# Altium schematic sheet 12V_Buck.SchDoc: 12.1V Buck Converter
size A; DrawnBy: Brent; DocumentNumber: XXXXXX; Revision: A; SheetNumber: 7; SheetTotal: 8
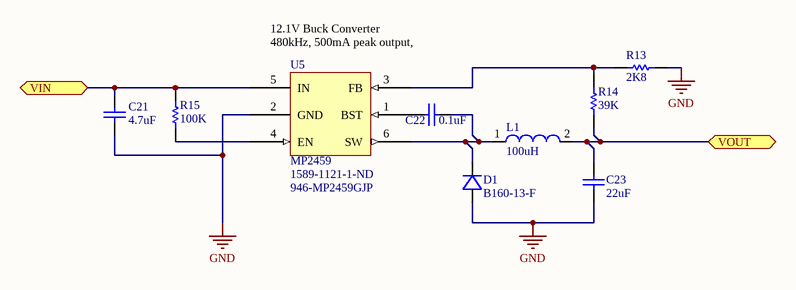
[diagram p0: 12V_Buck.SchDoc]

## Parts
C21  4.7uF  [CAPC1210(3225)280_L]
C22  0.1uF  [CAPC0603(1608)100_L]
C23  22uF  [CAPC1210(3225)210_L]
D1  B160-13-F  [DO-214AC]
L1  100uH  [WE-PD-XS-PB]
R13  2K8  [RESC0603(1608)_L]
R14  39K  [RESC0603(1608)_L]
R15  100K  [RESC0603(1608)_N]
U5  MP2459  Supplier Part Number 1: 1589-1121-1-ND  Supplier Part Number 2: 946-MP2459GJP  [TSOT23-6]

## Ports
VIN, VOUT

## Nets
GND: C21.1 C23.1 D1.2(A) R13.1 U5.2(GND)
VIN: C21.2 R15.2 U5.5(IN) ; port VIN
VOUT: C23.2 L1.2 R14.2 ; port VOUT
NetC22_1: C22.1 U5.1(BST)
NetC22_2: C22.2 D1.1(K) L1.1 U5.6(SW)
NetR13_2: R13.2 R14.1 U5.3(FB)
NetR15_1: R15.1 U5.4(EN)

## Notes on the sheet
- (near U5) 12.1V Buck Converter
  480kHz, 500mA peak output, 4.5V-55V input

## Library data of the parts
C21 = CMP-1038-02163-1: CAP 4.7uF 50V ±20% 1210 (3225 Metric) Thickness 2.8mm SMD; Case-EIA: 1210; Case-Metric: 3225; Tolerance: Â±20%; Max Thickness: 2.8 mm; Rated Voltage: 50 V; Technology: SMT; Value: 4.7uF
C22 = CMP-1035-02595-1: CAP 100nF 100V ±10% 0603 (1608 Metric) Thickness 1mm SMD; Tolerance: Â±10%; Case-EIA: 0603; Case-Metric: 1608; Rated Voltage: 100 V; Value: 100nF; Technology: SMT; Max Thickness: 1 mm
C23 = CMP-1038-02278-1: CAP 22uF 16V ±20% 1210 (3225 Metric) Thickness 2.05mm SMD; Case-Metric: 3225; Case-EIA: 1210; Tolerance: Â±20%; Rated Voltage: 16 V; Value: 22uF; Technology: SMT; Max Thickness: 2.05 mm
L1 = CMP-0227-00265-1: SMD-Shielded Power Inductor WE-PD, L = 100 µH; Inductance: 100 ÂµH; ComponentLink1Description: Manufacturer Link; PackageDescription: SMD Inductor, 2-Leads, Body 5.9 x 6.2 mm; ComponentLink1URL: http://www.we-online.com; ComponentLink2URL: http://www.we-online.de/katalog/media/pdf/744778520.pdf; ComponentLink2Description: Datasheet; PackageVersion: 2004; DatasheetVersion: ver 2, Oct-2004; PackageReference: WE-PD-XS-PB
R13 = CMP-1012-00559-1: 2K8 0.1W 1% 0603 (1608 Metric)  SMD; Case-EIA: 0603; Case-Metric: 1608; Value: 2800.00 Ohm; Tolerance: 1 %; Technology: SMT; Power: 0.1 W
R14 = CMP-1012-00689-1: 39K 0.1W 1% 0603 (1608 Metric)  SMD; Case-Metric: 1608; Case-EIA: 0603; Value: 39000.00 Ohm; Technology: SMT; Tolerance: 1 %; Power: 0.1 W
R15 = CMP-1012-00736-1: 100K 0.1W 1% 0603 (1608 Metric)  SMD; Value: 100000.00 Ohm; Case-Metric: 1608; Case-EIA: 0603; Power: 0.1 W; Tolerance: 1 %; Technology: SMT
D1 = B160-13-F: Supplier 1: Digikey
U5 = MP2459: Supplier 1: Digikey; Supplier 2: Mouser